# EAGLE design 16-key Pro Micro (EAGLE 9.1.3)
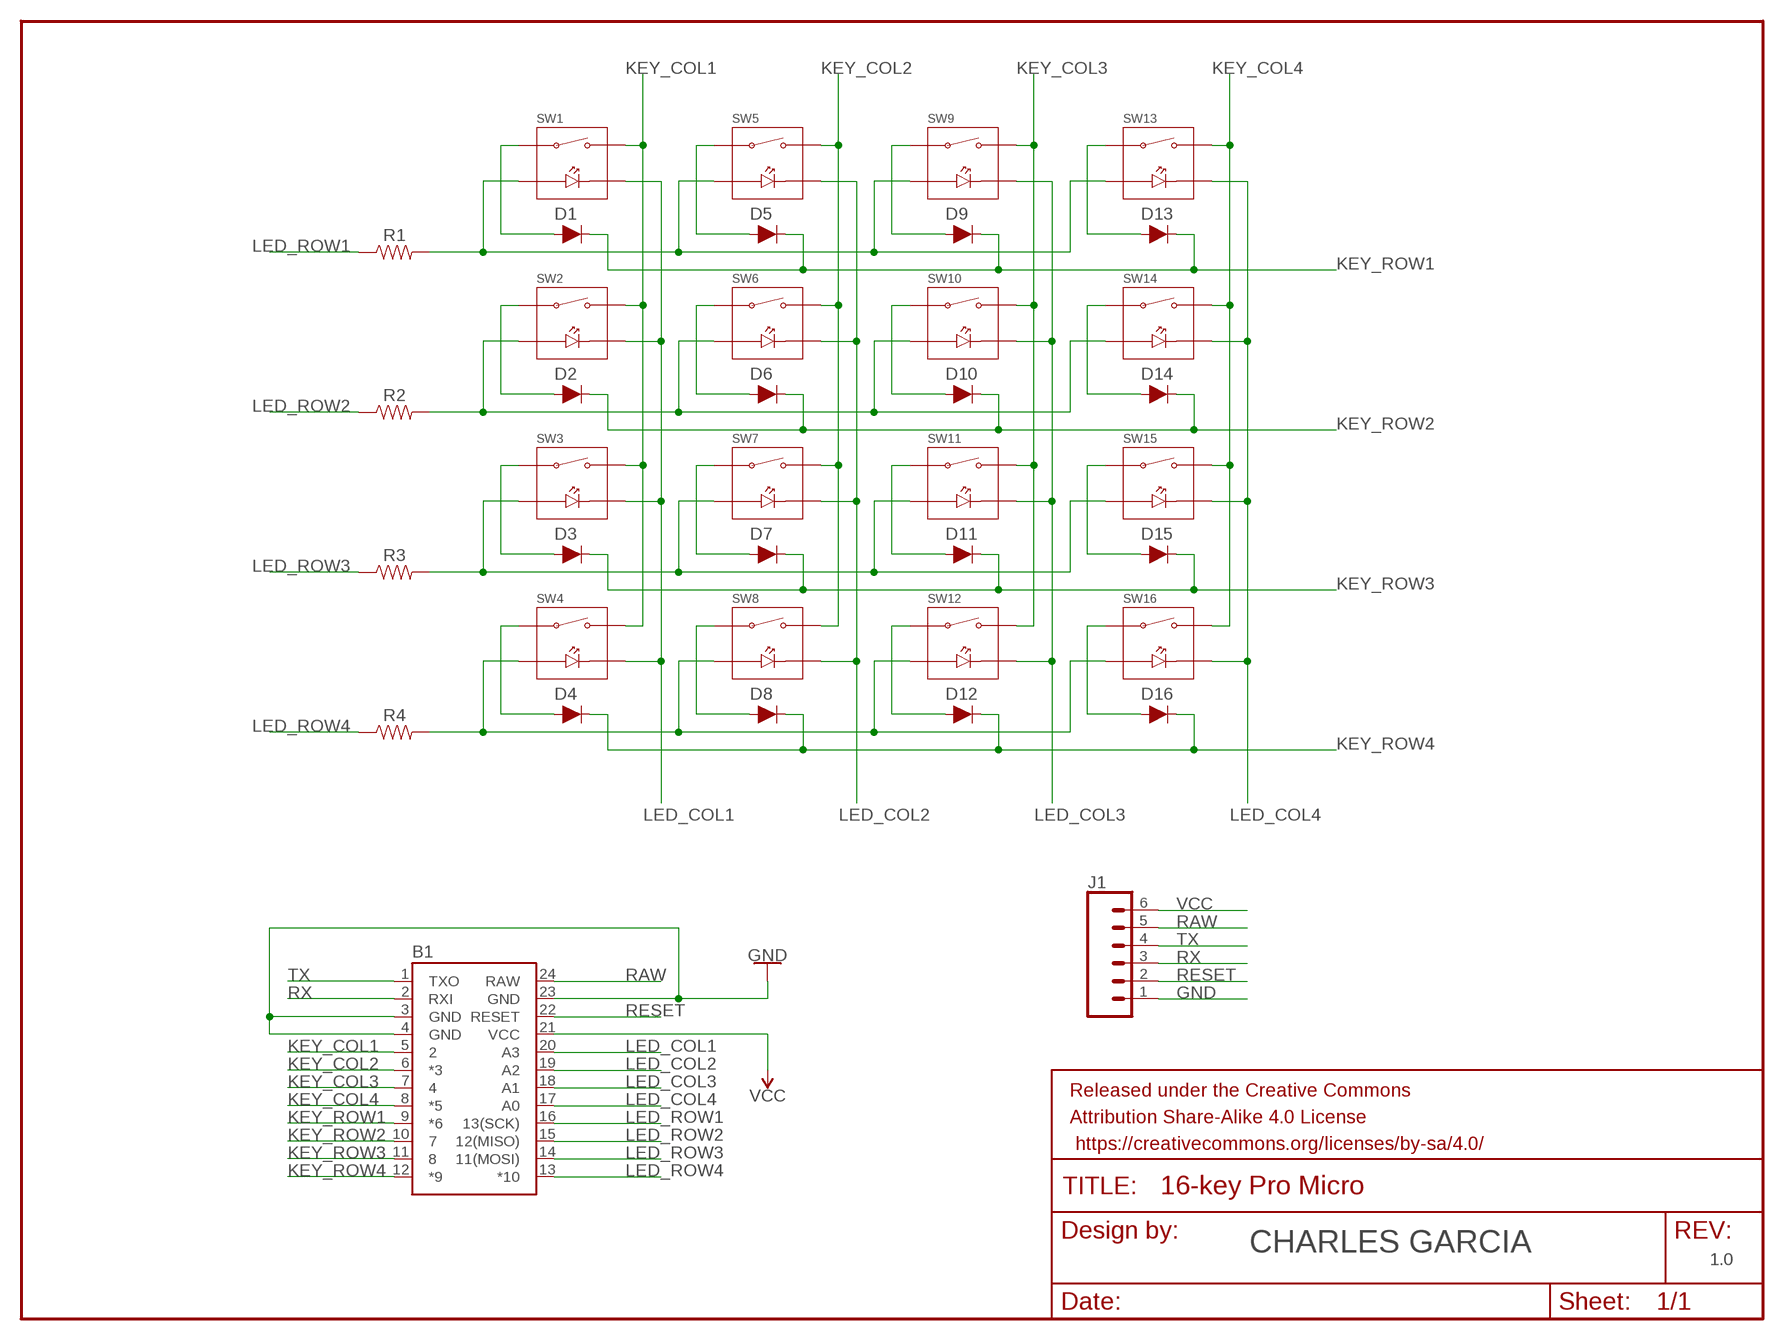
[diagram p0: schematic, sheet 1]

## Parts
B1  SPARKFUN_PRO_MICRO  [SPARKFUN_PRO_MICRO]
D1  DIODE-1N4148  [DIODE-1N4148]
D2  DIODE-1N4148  [DIODE-1N4148]
D3  DIODE-1N4148  [DIODE-1N4148]
D4  DIODE-1N4148  [DIODE-1N4148]
D5  DIODE-1N4148  [DIODE-1N4148]
D6  DIODE-1N4148  [DIODE-1N4148]
D7  DIODE-1N4148  [DIODE-1N4148]
D8  DIODE-1N4148  [DIODE-1N4148]
D9  DIODE-1N4148  [DIODE-1N4148]
D10  DIODE-1N4148  [DIODE-1N4148]
D11  DIODE-1N4148  [DIODE-1N4148]
D12  DIODE-1N4148  [DIODE-1N4148]
D13  DIODE-1N4148  [DIODE-1N4148]
D14  DIODE-1N4148  [DIODE-1N4148]
D15  DIODE-1N4148  [DIODE-1N4148]
D16  DIODE-1N4148  [DIODE-1N4148]
FRAME1  FRAME-LETTER  [CREATIVE_COMMONS]
J1  CONN_06SILK_FEMALE_PTH  [1X06]
R1  RESISTORAXIAL-0.3  [AXIAL-0.3]
R2  RESISTORAXIAL-0.3  [AXIAL-0.3]
R3  RESISTORAXIAL-0.3  [AXIAL-0.3]
R4  RESISTORAXIAL-0.3  [AXIAL-0.3]
SW1  CHERRY_MX_PCB_LED  [MX_PCB_MOUNT_LED]
SW2  CHERRY_MX_PCB_LED  [MX_PCB_MOUNT_LED]
SW3  CHERRY_MX_PCB_LED  [MX_PCB_MOUNT_LED]
SW4  CHERRY_MX_PCB_LED  [MX_PCB_MOUNT_LED]
SW5  CHERRY_MX_PCB_LED  [MX_PCB_MOUNT_LED]
SW6  CHERRY_MX_PCB_LED  [MX_PCB_MOUNT_LED]
SW7  CHERRY_MX_PCB_LED  [MX_PCB_MOUNT_LED]
SW8  CHERRY_MX_PCB_LED  [MX_PCB_MOUNT_LED]
SW9  CHERRY_MX_PCB_LED  [MX_PCB_MOUNT_LED]
SW10  CHERRY_MX_PCB_LED  [MX_PCB_MOUNT_LED]
SW11  CHERRY_MX_PCB_LED  [MX_PCB_MOUNT_LED]
SW12  CHERRY_MX_PCB_LED  [MX_PCB_MOUNT_LED]
SW13  CHERRY_MX_PCB_LED  [MX_PCB_MOUNT_LED]
SW14  CHERRY_MX_PCB_LED  [MX_PCB_MOUNT_LED]
SW15  CHERRY_MX_PCB_LED  [MX_PCB_MOUNT_LED]
SW16  CHERRY_MX_PCB_LED  [MX_PCB_MOUNT_LED]

## Nets
GND: B1.3(GND) B1.4(GND) B1.23(GND) J1.1
KEY_COL1: B1.5 SW1.SW_OUT SW2.SW_OUT SW3.SW_OUT SW4.SW_OUT
KEY_COL2: B1.6(*3) SW5.SW_OUT SW6.SW_OUT SW7.SW_OUT SW8.SW_OUT
KEY_COL3: B1.7 SW9.SW_OUT SW10.SW_OUT SW11.SW_OUT SW12.SW_OUT
KEY_COL4: B1.8(*5) SW13.SW_OUT SW14.SW_OUT SW15.SW_OUT SW16.SW_OUT
KEY_ROW1: B1.9(*6) D1.C D5.C D9.C D13.C
KEY_ROW2: B1.10 D2.C D6.C D10.C D14.C
KEY_ROW3: B1.11 D3.C D7.C D11.C D15.C
KEY_ROW4: B1.12(*9) D4.C D8.C D12.C D16.C
LED_COL1: B1.20(A3) SW1.LED_OUT SW2.LED_OUT SW3.LED_OUT SW4.LED_OUT
LED_COL2: B1.19(A2) SW5.LED_OUT SW6.LED_OUT SW7.LED_OUT SW8.LED_OUT
LED_COL3: B1.18(A1) SW9.LED_OUT SW10.LED_OUT SW11.LED_OUT SW12.LED_OUT
LED_COL4: B1.17(A0) SW13.LED_OUT SW14.LED_OUT SW15.LED_OUT SW16.LED_OUT
LED_ROW1: B1.16(13(SCK)) R1.P$1
LED_ROW2: B1.15(12(MISO)) R2.P$1
LED_ROW3: B1.14(11(MOSI)) R3.P$1
LED_ROW4: B1.13(*10) R4.P$1
N$1: D1.A SW1.SW_IN
N$2: D2.A SW2.SW_IN
N$3: D3.A SW3.SW_IN
N$4: D4.A SW4.SW_IN
N$7: D5.A SW5.SW_IN
N$8: D6.A SW6.SW_IN
N$9: D7.A SW7.SW_IN
N$10: D8.A SW8.SW_IN
N$13: D9.A SW9.SW_IN
N$14: D10.A SW10.SW_IN
N$15: D11.A SW11.SW_IN
N$16: D12.A SW12.SW_IN
N$19: D13.A SW13.SW_IN
N$20: D14.A SW14.SW_IN
N$21: D15.A SW15.SW_IN
N$22: D16.A SW16.SW_IN
N$25: R1.P$2 SW1.LED_IN SW5.LED_IN SW9.LED_IN SW13.LED_IN
N$26: R2.P$2 SW2.LED_IN SW6.LED_IN SW10.LED_IN SW14.LED_IN
N$27: R3.P$2 SW3.LED_IN SW7.LED_IN SW11.LED_IN SW15.LED_IN
N$28: R4.P$2 SW4.LED_IN SW8.LED_IN SW12.LED_IN SW16.LED_IN
RAW: B1.24(RAW) J1.5
RESET: B1.22(RESET) J1.2
RX: B1.2(RXI) J1.3
TX: B1.1(TXO) J1.4
VCC: B1.21(VCC) J1.6

## Library data of the parts
B1 = SparkFun-Boards:SPARKFUN_PRO_MICRO: SparkFun Pro Micro Atmega32U4 compatible footprint. SparkFun Products: 3.3V/8MHz <https://www.sparkfun.com/products/12587> 5V/16MHz <https://www.sparkfun.com/products/12640>
D1-D16 = SparkFun-DiscreteSemi:DIODE: Diode These are standard reverse protection diodes and small signal diodes. SparkFun Products: SparkFun SparkPunk Sound Kit <https://www.sparkfun.com/products/11177> SparkFun ESP8266 Thing <https://www.sparkfun.com/products/13231>; PROD_ID: DIO-08378; VALUE: 200mA/100V/1V
FRAME1 = SparkFun-Aesthetics:FRAME-LETTER: Schematic Frame - Letter Standard 8.5x11 US Letter frame; AUTHOR: CHARLES GARCIA; REV: 1.0
J1 = SparkFun-Connectors:CONN_06: Multi connection point. Often used as Generic Header-pin footprint for 0.1 inch spaced/style header connections On any of the 0.1 inch spaced packages, you can populate with these: Break Away Headers - Straight <https://www.sparkfun.com/products/116> (PRT-00116) Break Away Male Headers - Right Angle <https://www.sparkfun.com/products/553> (PRT-00553) Female Headers <https://www.sparkfun.com/products/115> (PRT-00115) Break Away Headers - Machine Pin <https://www.sparkfun.com/products/117> (PRT-00117) Break Away Female Headers - Swiss Machine Pin <https://www.sparkfun.com/products/743> (PRT-00743) Arduino Stackable Header - 6 Pin <https://www.sparkfun.com/products/9280> (PRT-09280) For SCREWTERMINALS and SPRING TERMINALS visit here: Screw Terimnals on SparkFun.com <https://www.sparkfun.com/search/results?term=Screw+Terminals> (5mm/3.5mm/2.54mm spacing) This device is also useful as a general connection point to wire up your design to another part of your project. Our various solder wires solder well into these plated through hole pads. Hook-Up Wire - Assortment (Stranded, 22 AWG) <https://www.sparkfun.com/products/11375> (PRT-11375) Hook-Up Wire - Assortment (Solid Core, 22 AWG) <https://www.sparkfun.com/products/11367> (PRT-11367) View the entire wire category on our website here <https://www.sparkfun.com/categories/141>; PROD_ID: CONN-08437
R1-R4 = SparkFun-Resistors:RESISTOR: Generic Resistor Package
SW1-SW16 = lib_keyswitch-1.0:CHERRY_MX_PCB_LED

## Board
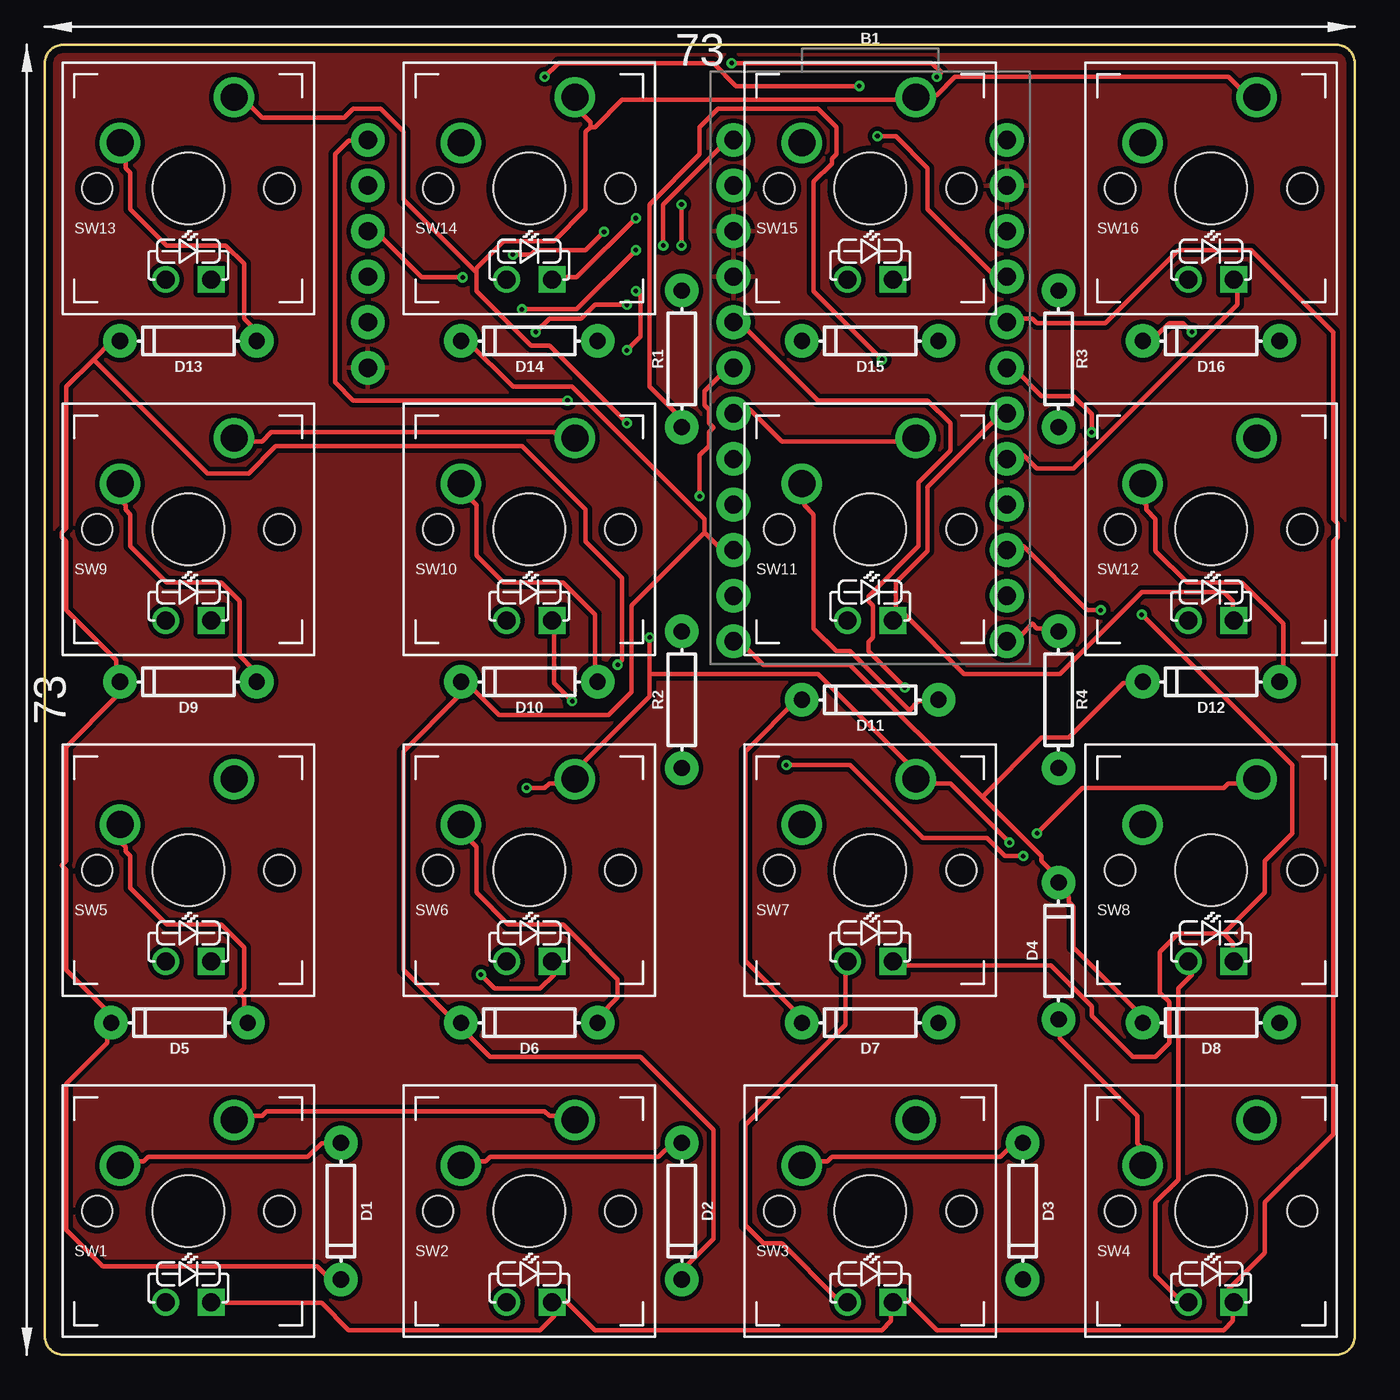
[diagram p1: board, top side]
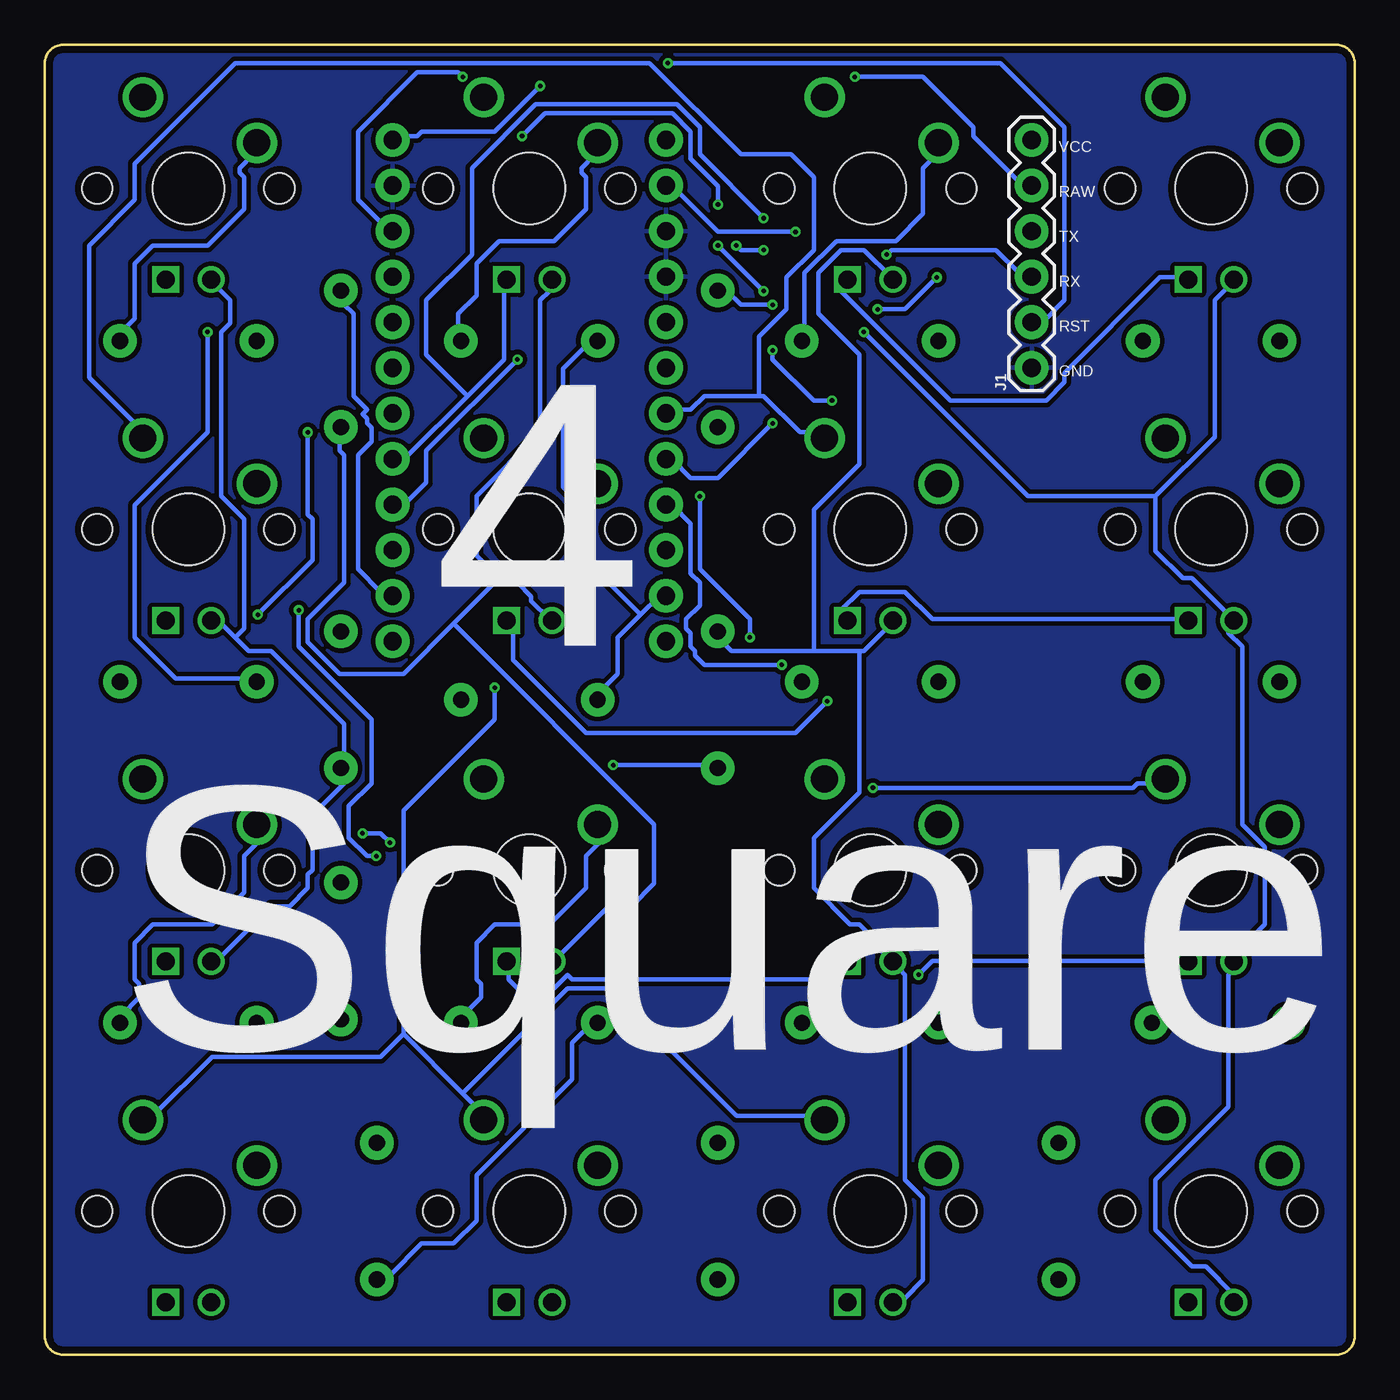
[diagram p2: board, bottom side, seen from below]

Size 73 x 73 mm. Coordinates in mm from the lower left corner, seen from the top.
Outline: 1,73 72,73 arc-90 73,72 73,1 arc-90 72,0 1,0 arc-90 0,1 0,72 arc-90 1,73
Copper layers (1*16): Top 0.035559375mm / dielectric 1.6mm / Bottom 0.035559375mm
Design rules "oshpark-2layer-auto-routing": minimum track width 10mil, minimum drill 10mil, track to track 10mil, track to pad 8mil, pad to pad 8mil, via to via 8mil, smd to smd 6mil, copper to edge 15mil, drill to drill 6mil, minimum pad ring 6mil, minimum via ring 6mil, stop-mask expansion 2.5mil, vias tented up to drill 0mil, thermal gap 10mil

### Footprints (pad centres in the part's own frame; a part is rotated, then mirrored left to right if it is on the bottom)
SPARKFUN_PRO_MICRO = drill 1.016 pad 1.88: 1 -7.62,12.7; 2 -7.62,10.16; 3 -7.62,7.62; 4 -7.62,5.08; 5 -7.62,2.54; 6 -7.62,0; 7 -7.62,-2.54; 8 -7.62,-5.08; 9 -7.62,-7.62; 10 -7.62,-10.16; 11 -7.62,-12.7; 12 -7.62,-15.24; 13 7.62,-15.24; 14 7.62,-12.7; 15 7.62,-10.16; 16 7.62,-7.62; 17 7.62,-5.08; 18 7.62,-2.54; 19 7.62,0; 20 7.62,2.54; 21 7.62,5.08; 22 7.62,7.62; 23 7.62,10.16; 24 7.62,12.7
DIODE-1N4148 = drill 0.9 pad 1.88: A -3.81,0; C 3.81,0
1X06 = drill 1.016 pad 1.88: 1 0,0; 2 2.54,0; 3 5.08,0; 4 7.62,0; 5 10.16,0; 6 12.7,0
AXIAL-0.3 = drill 0.9 pad 1.88: P$1 -3.81,0; P$2 3.81,0
MX_PCB_MOUNT_LED = drill 0.991: LED_IN -1.27,-5.08 | drill 0.991 square: LED_OUT 1.27,-5.08 | drill 1.499: SW_IN -3.81,2.54; SW_OUT 2.54,5.08 | hole 3.988: 0,0 | hole 1.702: -5.08,0; 5.08,0

### Placement (x,y rotation side)
B1  46,55 0 top
D1  16.5,8 270 top
D2  35.5,8 270 top
D3  54.5,8 270 top
D4  56.5,22.5 90 top
D5  7.5,18.5 180 top
D6  27,18.5 180 top
D7  46,18.5 180 top
D8  65,18.5 180 top
D9  8,37.5 180 top
D10  27,37.5 180 top
D11  46,36.5 180 top
D12  65,37.5 180 top
D13  8,56.5 180 top
D14  27,56.5 180 top
D15  46,56.5 180 top
D16  65,56.5 180 top
FRAME1  13,-9 0 top  (outside the outline)
J1  18,55 90 bottom
R1  35.5,55.5 90 top
R2  35.5,36.5 90 top
R3  56.5,55.5 270 top
R4  56.5,36.5 270 top
SW1  8,8 0 top
SW2  27,8 0 top
SW3  46,8 0 top
SW4  65,8 0 top
SW5  8,27 0 top
SW6  27,27 0 top
SW7  46,27 0 top
SW8  65,27 0 top
SW9  8,46 0 top
SW10  27,46 0 top
SW11  46,46 0 top
SW12  65,46 0 top
SW13  8,65 0 top
SW14  27,65 0 top
SW15  46,65 0 top
SW16  65,65 0 top

### Tracks (layer width: path | path; a pad name or v marks a point on that pad's centre or on a via)
GND
  pour Top: 0,72 arc-90 1,73 72,73 arc-90 73,72 73,1 arc-90 72,0 1,0 arc-90 0,1
  pour Bottom: 0,72 arc-90 1,73 72,73 arc-90 73,72 73,1 arc-90 72,0 1,0 arc-90 0,1
KEY_COL1  (via drill 0.25)
  Top 0.254: SW1.SW_OUT 10.59,13.3 12.11,13.3 12.37,13.56 27.86,13.56 28.12,13.3 29.39,13.3 SW2.SW_OUT | v47.93,37.18 45.9,39.21 45.9,39.72 46.15,39.97 46.15,41.75 45.9,42.01 45.9,42.26 48.69,45.05 48.69,48.61 50.47,50.39 50.47,51.91 49.2,53.18 43.1,53.18 38.78,57.5 38.53,57.5 B1.5
  Bottom 0.254: v47.93,37.18 47.93,35.4 53.01,30.32 53.01,17.88 | 49.71,14.57 48.44,13.3 SW3.SW_OUT | 49.71,14.57 53.01,17.88 | 53.01,17.88 54.28,16.61 63.68,16.61 66.98,13.3 67.49,13.3 SW4.SW_OUT | 49.71,14.57 43.86,20.42 41.58,20.42 34.47,13.3 29.64,13.3 SW2.SW_OUT
KEY_COL2  (via drill 0.25)
  Top 0.254: v36.5,47.85 36.5,50.13 37.01,50.64 37.01,51.4 37.26,51.66 37.01,51.91 37.01,52.67 36.75,52.93 36.75,53.69 38.02,54.96 38.28,54.96 B1.6 | 33.7,37.94 33.7,36.67 29.64,32.61 29.64,32.1 SW6.SW_OUT 29.39,31.85 28.12,31.85 27.86,31.59 v26.85,31.59 | 33.7,37.94 v33.7,39.97 | 33.7,37.94 43.1,37.94 48.44,32.61 48.44,32.1 SW7.SW_OUT 48.69,31.85 50.47,31.85 v53.77,28.54 | v55.29,29.05 57.83,31.59 65.71,31.59 65.96,31.85 67.49,31.85 SW8.SW_OUT
  Bottom 0.254: v36.5,47.85 36.5,43.78 33.7,40.99 v33.7,39.97 | v26.85,31.59 12.37,31.59 12.11,31.85 10.59,31.85 SW5.SW_OUT | v55.29,29.05 54.28,29.05 v53.77,28.54
KEY_COL3
  Top 0.254: SW9.SW_OUT 10.59,50.9 12.11,50.9 12.62,51.4 28.37,51.4 28.62,51.15 29.39,51.15 SW10.SW_OUT | SW11.SW_OUT 48.44,50.9 41.07,50.9 39.29,52.67 38.53,52.67 B1.7
  Bottom 0.254: 33.2,53.44 32.94,53.44 30.91,51.4 29.89,51.4 29.64,51.15 SW10.SW_OUT | 33.2,53.44 36.24,53.44 37.01,52.67 38.28,52.67 B1.7 | 33.2,53.44 33.2,56.74 31.67,58.26 31.67,60.04 30.15,61.56 30.15,65.63 31.42,66.9 34.21,66.9 39.29,71.98 62.41,71.98 67.99,66.39 67.99,64.36 70.53,61.82 70.53,54.45 67.74,51.66 67.74,51.15 SW12.SW_OUT
KEY_COL4  (via drill 0.25)
  Top 0.254: v32.43,51.91 28.12,56.23 27.1,56.23 24.05,59.28 24.05,60.29 | 24.05,60.29 24.05,60.55 25.58,62.07 28.37,62.07 30.15,63.85 30.15,68.17 30.4,68.42 | 30.4,68.42 30.4,68.68 29.64,69.44 29.64,69.95 SW14.SW_OUT | 24.05,60.29 19.99,64.36 19.99,68.17 18.72,69.44 17.19,69.44 16.69,68.93 12.11,68.93 11.1,69.95 10.59,69.95 SW13.SW_OUT | 30.4,68.42 30.66,68.42 32.18,69.95 48.44,69.95 SW15.SW_OUT 48.69,70.2 49.71,70.2 50.72,71.22 65.96,71.22 66.98,70.2 67.49,70.2 SW16.SW_OUT
  Bottom 0.254: v32.43,51.91 35.48,48.86 37.01,48.86 38.02,49.88 38.28,49.88 B1.8
KEY_ROW1  (via drill 0.25)
  Top 0.254: D1.C 16.43,4.41 15.67,4.41 15.16,4.92 3.22,4.92 1.19,6.95 1.19,15.08 3.48,17.37 3.48,18.38 D5.C 3.48,18.64 3.48,19.15 1.19,21.43 1.19,27.02 0.94,27.27 1.19,27.53 1.19,33.88 3.99,36.67 3.99,37.43 D9.C 3.99,37.69 3.99,38.7 1.19,41.5 1.19,45.31 0.94,45.56 0.94,45.82 1.19,46.07 1.19,53.94 2.72,55.47 | 2.72,55.47 3.73,56.48 3.99,56.48 D13.C | v31.93,38.45 32.18,38.7 32.18,43.28 30.15,45.31 30.15,47.09 26.59,50.64 12.88,50.64 11.35,49.12 9.07,49.12 2.72,55.47
  Bottom 0.254: v31.93,38.45 36.24,38.45 36.75,38.96 36.75,39.21 37.01,39.47 37.01,40.23 37.26,40.48 37.26,40.99 36.5,41.75 36.5,43.02 37.01,43.53 37.01,46.32 38.02,47.34 38.28,47.34 B1.9
KEY_ROW2
  Top 0.254: 36.75,45.82 36.75,46.58 29.39,53.94 26.08,53.94 23.54,56.48 23.29,56.48 D14.C | 36.75,45.82 37.51,45.05 38.28,45.05 B1.10 | D2.C 35.74,4.41 35.74,4.92 37.26,6.45 37.26,12.54 33.2,16.61 24.81,16.61 23.04,18.38 D6.C 23.04,18.64 22.78,18.64 19.99,21.43 19.99,33.62 23.04,36.67 23.04,37.43 D10.C 23.29,37.69 25.32,35.66 31.42,35.66 32.69,36.93 32.69,41.75 36.75,45.82
KEY_ROW3
  Top 0.254: D7.C 42.09,18.64 42.09,18.89 39.04,21.94 39.04,33.62 42.09,36.67 D11.C
  Bottom 0.254: D3.C 54.28,4.41 53.77,4.41 51.99,6.19 50.21,6.19 48.94,7.46 48.94,10 43.61,15.34 43.61,17.37 42.34,18.64 D7.C | 39.8,41.24 41.07,39.97 41.07,37.94 42.34,36.67 D11.C | 39.8,41.24 38.78,42.26 38.53,42.26 B1.11 | 39.8,41.24 42.85,44.29 42.85,46.58 43.1,46.83 43.1,47.34 44.12,48.36 44.12,54.96 42.59,56.48 42.34,56.48 D15.C
KEY_ROW4  (via drill 0.25)
  Top 0.254: 52.25,31.08 55.55,27.78 55.55,27.53 56.56,26.51 D4.C 56.31,26.26 57.07,25.5 57.07,25.24 57.33,24.99 57.33,22.7 61.14,18.89 61.14,18.64 D8.C | 52.25,31.08 44.88,38.45 40.05,38.45 38.78,39.72 38.53,39.72 B1.12 | 52.25,31.08 55.55,34.39 57.07,34.39 60.12,37.43 61.14,37.43 D12.C | v63.93,56.99 63.42,57.5 62.66,57.5 61.9,56.74 61.39,56.74 D16.C
  Bottom 0.254: v63.93,56.99 63.93,51.4 67.99,47.34 67.99,39.97 65.71,37.69 61.39,37.69 D12.C
LED_COL1
  Top 0.254: SW1.LED_OUT 9.32,2.89 15.42,2.89 16.94,1.37 27.61,1.37 28.37,2.13 28.37,2.89 SW2.LED_OUT 28.37,3.14 28.88,3.14 30.66,1.37 46.66,1.37 47.17,1.87 47.17,2.89 SW3.LED_OUT 47.42,3.14 47.93,3.14 49.71,1.37 65.71,1.37 66.22,1.87 66.22,2.89 SW4.LED_OUT 66.22,3.14 65.96,3.4 65.96,3.65 67.99,5.68 67.99,8.48 71.8,12.29 71.8,45.31 72.06,45.56 72.06,46.32 71.8,46.58 71.8,56.99 67.23,61.56 63.17,61.56 59.1,57.5 55.29,57.5 55.04,57.75 53.77,57.75 B1.20
LED_COL2  (via drill 0.25)
  Top 0.254: v24.31,21.18 25.07,20.42 27.61,20.42 28.37,21.18 28.37,21.69 SW6.LED_OUT | 65.71,23.46 66.22,22.96 66.22,21.94 SW8.LED_OUT | 65.71,23.46 63.17,23.46 62.15,22.45 62.15,20.16 62.66,19.65 62.66,17.37 61.9,16.61 60.63,16.61 58.34,18.89 58.34,19.4 56.06,21.69 47.42,21.69 SW7.LED_OUT | v58.34,51.4 58.34,52.42 57.33,53.44 55.55,53.44 54.02,54.96 53.77,54.96 B1.19 | v61.14,41.24 69.52,32.86 69.52,29.05 67.99,27.53 67.99,25.75 65.71,23.46
  Bottom 0.254: v24.31,21.18 23.54,21.94 9.32,21.94 SW5.LED_OUT | SW7.LED_OUT 47.17,21.69 47.17,20.92 46.66,20.42 44.63,20.42 43.86,21.18 43.61,20.92 30.15,20.92 28.88,22.19 28.62,22.19 28.37,21.94 SW6.LED_OUT | v58.34,51.4 58.34,46.83 58.09,46.58 58.09,44.29 v61.14,41.24
LED_COL3  (via drill 0.25)
  Top 0.254: 47.42,41.24 47.42,43.02 49.2,44.8 49.2,48.36 53.52,52.67 B1.18 | 47.42,41.24 47.42,40.99 SW11.LED_OUT 47.42,41.24 | 47.42,41.24 47.93,41.24 51.23,37.94 56.56,37.94 61.14,42.51 65.71,42.51 66.22,42.01 66.22,40.99 SW12.LED_OUT | v29.39,36.42 28.37,37.43 28.37,40.74 SW10.LED_OUT
  Bottom 0.254: SW9.LED_OUT 9.32,40.99 23.54,40.99 25.07,42.51 27.61,42.51 28.62,41.5 28.62,41.24 28.37,40.99 SW10.LED_OUT | v29.39,36.42 31.16,34.64 42.85,34.64 46.91,38.7 46.91,40.48 47.17,40.74 SW11.LED_OUT
LED_COL4  (via drill 0.25)
  Top 0.254: SW16.LED_OUT 66.47,59.79 66.47,58.52 57.33,49.37 55.29,49.37 54.53,50.13 53.77,50.13 B1.17 | v32.94,63.34 29.64,60.04 28.37,60.04 SW14.LED_OUT
  Bottom 0.254: SW13.LED_OUT 9.32,60.04 10.84,60.04 16.18,54.71 16.18,54.2 17.19,53.18 22.53,53.18 28.62,59.28 28.62,59.53 28.37,59.79 SW14.LED_OUT | 49.45,53.44 52.75,50.13 53.52,50.13 B1.17 | 49.45,53.44 47.42,55.47 47.42,59.79 SW15.LED_OUT | v32.94,63.34 36.5,66.9 36.5,68.42 37.77,69.69 45.64,69.69 49.2,66.14 49.2,61.31 51.74,58.77 51.74,55.72 49.45,53.44
LED_ROW1  (via drill 0.25)
  Top 0.254: v46.66,55.47 42.85,59.28 42.85,65.37 43.86,66.39 43.86,66.64 44.12,66.9 44.12,68.42 43.1,69.44 37.51,69.44 36.5,68.42 36.5,66.9 33.7,64.1 33.7,53.94 35.48,52.17 35.48,51.91 R1.P$1
  Bottom 0.254: v46.66,55.47 51.74,50.39 51.74,48.61 52.75,47.59 53.52,47.59 B1.16
LED_ROW2  (via drill 0.25)
  Top 0.254: v41.32,32.86 44.88,32.86 48.94,28.8 52.5,28.8 53.52,27.78 v54.53,27.78 | v58.85,41.5 58.09,41.5 54.53,45.05 53.77,45.05 B1.15
  Bottom 0.254: v41.32,32.86 35.74,32.86 R2.P$1 | v54.53,27.78 55.04,27.78 56.06,28.8 56.06,30.58 54.79,31.85 54.79,35.4 58.85,39.47 v58.85,41.5
LED_ROW3
  Bottom 0.254: B1.14 53.77,42.51 54.28,42.51 55.55,43.78 55.55,50.13 54.79,50.9 54.79,51.66 55.04,51.91 55.04,52.17 55.29,52.42 55.04,52.67 55.8,53.44 55.8,58.01 56.31,58.52 56.31,59.28 R3.P$1
LED_ROW4
  Top 0.254: B1.13 53.77,39.97 54.28,39.97 55.04,40.74 55.29,40.48 56.31,40.48 R4.P$1
N$1
  Top 0.254: D1.A 16.43,11.78 15.42,11.78 14.65,11.02 5.76,11.02 5.51,10.76 4.24,10.76 SW1.SW_IN
N$2
  Top 0.254: D2.A 35.48,11.78 34.97,11.78 34.21,11.02 24.81,11.02 24.56,10.76 23.29,10.76 SW2.SW_IN
N$3
  Top 0.254: D3.A 54.28,11.78 54.02,11.78 53.26,11.02 43.86,11.02 43.61,10.76 42.34,10.76 SW3.SW_IN
N$4
  Top 0.254: D4.A 56.56,18.64 56.56,17.62 60.88,13.3 60.88,11.78 61.14,11.53 61.14,10.76 SW4.SW_IN
N$7
  Top 0.254: D5.A 11.1,18.64 11.1,19.91 10.84,20.16 11.1,20.42 11.1,22.7 9.83,23.97 6.78,23.97 4.75,26 4.75,27.78 4.49,28.04 4.49,28.29 4.24,28.54 4.24,29.31 SW5.SW_IN
N$8
  Top 0.254: D6.A 30.91,18.64 30.91,18.89 31.93,19.91 31.93,20.92 28.88,23.97 25.83,23.97 24.05,25.75 24.05,28.29 23.04,29.31 SW6.SW_IN
N$9
  Bottom 0.254: D7.A 49.71,18.64 49.71,18.89 48.69,19.91 48.69,20.67 48.94,20.92 48.94,22.96 47.93,23.97 44.88,23.97 42.85,26 42.85,27.78 42.09,28.54 42.09,29.31 SW7.SW_IN
N$10
  Bottom 0.254: D8.A 68.76,18.64 68.76,18.89 67.74,19.91 67.74,20.67 67.99,20.92 67.99,22.96 66.98,23.97 63.68,23.97 61.9,25.75 61.9,27.78 61.14,28.54 61.14,29.31 SW8.SW_IN
N$13
  Top 0.254: D9.A 11.61,37.69 11.61,38.2 10.84,38.96 10.84,42.01 9.83,43.02 6.78,43.02 4.75,45.05 4.75,46.83 4.49,47.09 4.49,47.34 4.24,47.59 4.24,48.36 SW9.SW_IN
N$14
  Top 0.254: D10.A 30.66,37.69 30.66,41.24 28.88,43.02 25.58,43.02 24.05,44.55 24.05,47.34 23.04,48.36 SW10.SW_IN
N$15
  Top 0.254: D11.A 49.71,36.42 48.69,36.42 48.18,35.91 44.88,39.21 44.12,39.21 42.85,40.48 42.85,46.83 42.34,47.34 42.34,48.36 SW11.SW_IN
N$16
  Top 0.254: D12.A 69.01,37.69 69.01,40.74 66.72,43.02 63.68,43.02 61.9,44.8 61.9,46.58 61.39,47.09 61.39,47.34 61.14,47.59 61.14,48.36 SW12.SW_IN
N$19
  Top 0.254: D13.A 11.61,56.74 11.61,57.25 11.1,57.75 11.1,60.8 10.08,61.82 6.78,61.82 4.75,63.85 4.75,65.88 4.49,66.14 4.49,67.15 4.24,67.41 SW13.SW_IN
N$20
  Bottom 0.254: D14.A 30.66,56.74 30.66,60.29 28.88,62.07 25.58,62.07 24.05,63.6 24.05,66.14 23.29,66.9 23.29,67.41 SW14.SW_IN
N$21
  Bottom 0.254: D15.A 49.96,56.74 49.96,58.01 48.94,59.02 48.94,60.8 47.67,62.07 44.63,62.07 42.85,63.85 42.85,65.63 43.1,65.88 43.1,66.14 42.34,66.9 42.34,67.41 SW15.SW_IN
N$22
  Bottom 0.254: D16.A 68.76,56.74 68.76,56.99 67.99,57.75 67.99,60.8 66.98,61.82 63.93,61.82 61.9,63.85 61.9,65.63 62.15,65.88 62.15,66.14 61.39,66.9 61.39,67.41 SW16.SW_IN
N$25  (via drill 0.25)
  Top 0.254: v32.43,58.52 30.66,58.52 29.89,57.75 28.12,57.75 v27.35,56.99
  Bottom 0.254: SW1.LED_IN 6.78,3.14 6.78,3.4 8.3,4.92 9.07,4.92 11.1,6.95 11.1,9.75 7.03,13.81 7.03,21.18 6.53,21.69 SW5.LED_IN 6.53,21.94 6.53,22.45 5,23.97 5,28.29 6.27,29.56 6.27,39.47 7.03,40.23 7.03,40.48 6.78,40.74 SW9.LED_IN 6.78,40.99 9.07,43.28 9.57,43.28 11.1,44.8 11.1,47.85 | 11.1,47.85 7.8,51.15 7.8,58.77 6.78,59.79 SW13.LED_IN | v32.43,58.52 34.21,58.52 34.97,59.28 35.48,59.28 R1.P$2 | v27.35,56.99 18.21,47.85 11.1,47.85
N$26
  Bottom 0.254: SW2.LED_IN 25.58,3.14 25.07,3.14 24.05,4.16 24.05,8.73 25.07,9.75 25.07,21.18 25.32,21.43 25.32,21.69 25.58,21.94 SW6.LED_IN 25.83,21.94 26.85,22.96 26.85,23.21 27.61,23.97 28.12,23.97 30.15,26 30.15,28.8 27.61,31.34 27.61,39.21 | 30.15,39.21 34.72,39.21 35.74,40.23 R2.P$2 | 30.15,39.21 27.61,39.21 | 27.61,39.21 27.35,39.21 25.83,40.74 SW10.LED_IN | 30.15,39.21 30.15,47.09 27.61,49.63 27.61,55.72 29.89,58.01 29.89,60.29 28.62,61.56 27.35,61.56 25.83,60.04 SW14.LED_IN
N$27
  Top 0.254: SW3.LED_IN 44.63,3.14 44.12,3.14 41.07,6.19 40.05,6.19 39.04,7.21 39.04,12.8 44.63,18.38 44.63,21.69 SW7.LED_IN
  Bottom 0.254: 47.67,43.28 48.94,44.55 48.94,47.85 45.39,51.4 45.39,58.77 44.88,59.28 44.88,59.79 SW15.LED_IN | 47.67,43.28 47.42,43.02 46.66,43.02 45.9,42.26 45.9,42.01 44.88,40.99 SW11.LED_IN | 47.67,43.28 50.21,40.74 | 50.21,40.74 53.01,37.94 56.56,37.94 58.34,39.72 58.34,40.99 56.31,43.02 56.31,50.13 56.56,50.39 56.56,51.66 R3.P$2 | 50.21,40.74 39.04,29.56 39.04,26.26 40.31,24.99 41.58,24.99 44.63,21.94 SW7.LED_IN
N$28
  Top 0.254: SW4.LED_IN 63.68,3.14 63.17,3.14 61.9,4.41 61.9,8.48 63.17,9.75 63.17,20.42 63.93,21.18 63.93,21.69 SW8.LED_IN
  Bottom 0.254: 62.41,39.97 61.64,39.21 60.37,39.21 56.31,35.15 56.31,32.86 R4.P$2 56.31,32.61 56.31,31.85 58.09,30.07 58.09,27.02 58.34,26.77 58.34,26 59.36,24.99 60.37,24.99 63.42,21.94 63.68,21.94 SW8.LED_IN | 62.41,39.97 63.17,40.74 63.68,40.74 SW12.LED_IN | 62.41,39.97 61.9,40.48 61.9,46.58 63.17,47.85 63.17,56.99 62.66,57.5 62.66,58.77 63.68,59.79 SW16.LED_IN
RAW  (via drill 0.25)
  Top 0.254: v27.86,71.22 28.62,71.98 37.26,71.98 38.53,70.71 v45.39,70.71
  Bottom 0.254: v27.86,71.22 24.05,71.22 21.26,68.42 21.26,67.91 18.72,65.37 18.21,65.37 J1.5 | v45.39,70.71 47.93,68.17 51.99,68.17 52.25,67.91 53.52,67.91 B1.24
RESET  (via drill 0.25)
  Top 0.254: v38.28,71.98 49.45,71.98 49.96,71.47 v49.71,71.22
  Bottom 0.254: v38.28,71.98 19.73,71.98 16.18,68.42 16.18,58.77 17.19,57.75 17.96,57.75 J1.2 | v49.71,71.22 49.96,71.47 52.25,71.47 55.55,68.17 55.55,64.36 53.77,62.58 B1.22
RX  (via drill 0.25)
  Top 0.254: v26.08,61.31 27.1,61.31 27.35,61.56 30.15,61.56 v31.16,62.58
  Bottom 0.254: v26.08,61.31 25.83,61.56 19.99,61.56 18.72,60.29 18.21,60.29 J1.3 | v31.16,62.58 35.48,62.58 38.28,65.37 B1.2
TX  (via drill 0.25)
  Top 0.254: v23.29,60.04 21,60.04 18.46,62.58 18.21,62.58 J1.4 | v26.59,58.26 29.64,58.26 v32.94,61.56 | v34.47,61.82 34.47,64.1 38.28,67.91 B1.1
  Bottom 0.254: v23.29,60.04 25.07,58.26 v26.59,58.26 | v32.94,61.56 34.21,61.56 v34.47,61.82
VCC  (via drill 0.25)
  Top 0.254: v29.13,53.18 17.19,53.18 16.18,54.2 16.18,66.9 16.94,67.66 17.96,67.66 J1.6 | v32.43,55.98 33.2,56.74 33.2,59.02 v32.94,59.28 | v35.48,64.1 v35.48,61.82 | v46.4,67.91 47.42,67.91 49.2,66.14 49.2,63.85 52.75,60.29 53.52,60.29 B1.21
  Bottom 0.254: v29.13,53.18 30.15,53.18 32.43,55.47 v32.43,55.98 | v35.48,61.82 v32.94,59.28 | v35.48,64.1 35.48,65.12 37.01,66.64 37.01,68.17 38.02,69.18 45.13,69.18 v46.4,67.91

### Text on the board
tPlace: Unit / Size
bPlace: VCC | RAW | TX | RX | RST | GND | 4 / Square